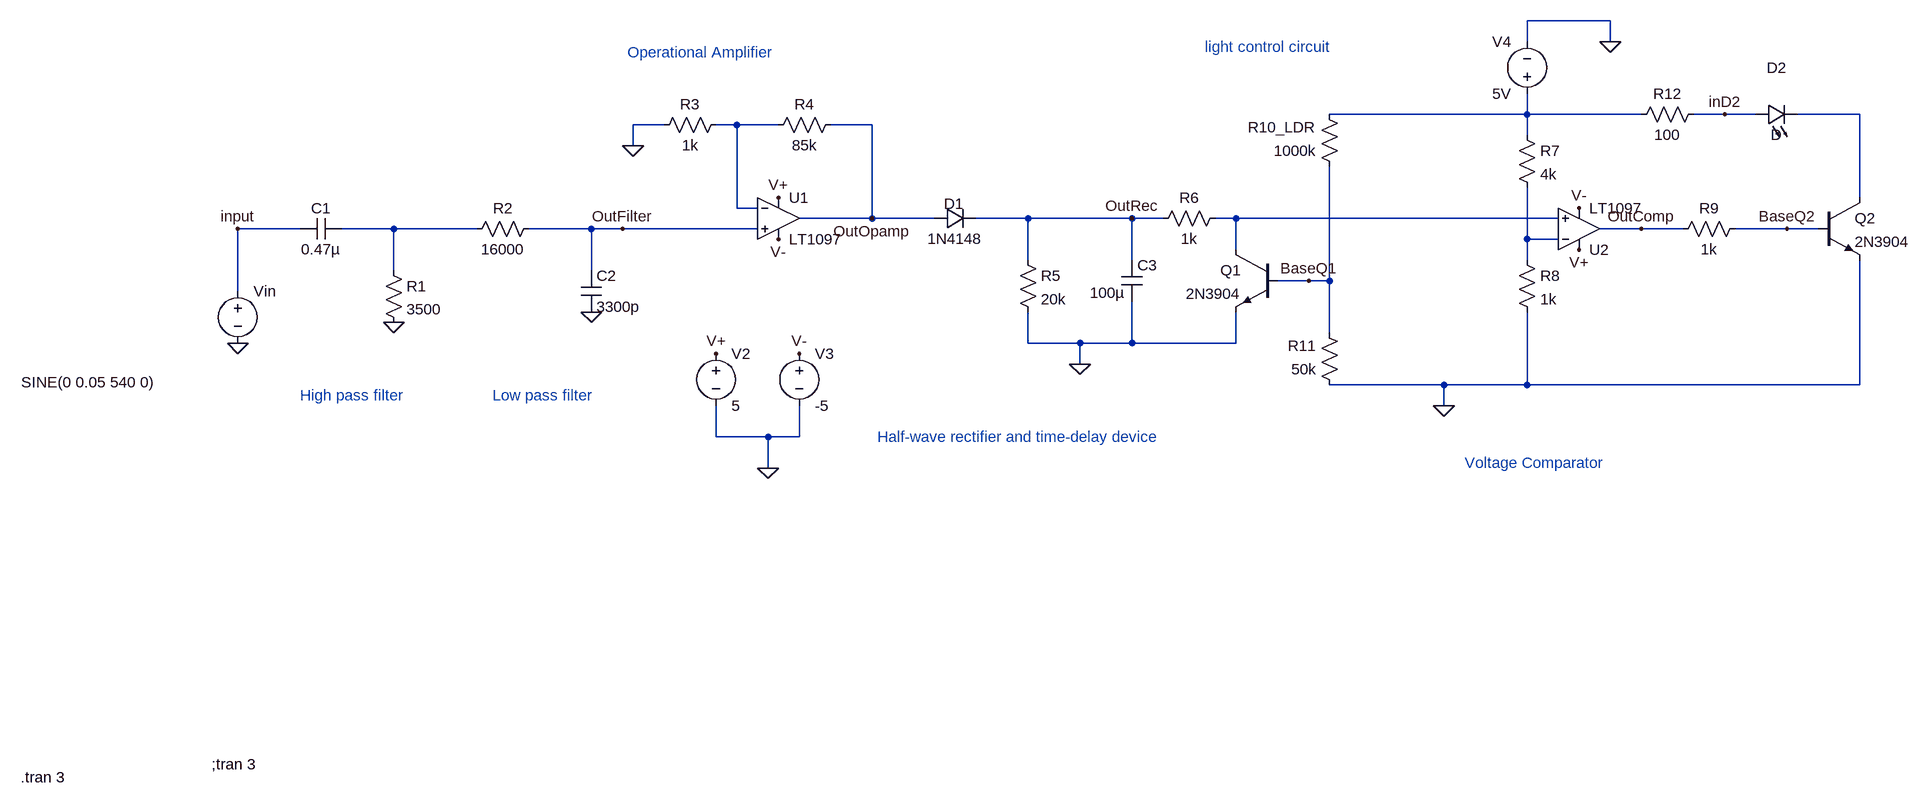
[diagram p0: schematic 3161ProjectDesign.asc]
3161ProjectDesign.asc, the LTspice schematic file:
Version 4
SHEET 1 2792 1004
WIRE 2048 -176 1920 -176
WIRE 1920 -144 1920 -176
WIRE 2048 -144 2048 -176
WIRE 1920 -32 1920 -64
WIRE 1920 -32 1616 -32
WIRE 2096 -32 1920 -32
WIRE 2224 -32 2176 -32
WIRE 2272 -32 2224 -32
WIRE 2432 -32 2336 -32
WIRE 592 -16 544 -16
WIRE 704 -16 672 -16
WIRE 768 -16 704 -16
WIRE 912 -16 848 -16
WIRE 1920 0 1920 -32
WIRE 544 16 544 -16
WIRE 2432 96 2432 -32
WIRE 704 112 704 -16
WIRE 736 112 704 112
WIRE 912 128 912 -16
WIRE 912 128 800 128
WIRE 1008 128 912 128
WIRE 1152 128 1072 128
WIRE 1312 128 1152 128
WIRE 1360 128 1312 128
WIRE 1472 128 1440 128
WIRE 1968 128 1472 128
WIRE 32 144 -64 144
WIRE 176 144 96 144
WIRE 304 144 176 144
WIRE 480 144 384 144
WIRE 528 144 480 144
WIRE 736 144 528 144
WIRE 2096 144 2032 144
WIRE 2160 144 2096 144
WIRE 2320 144 2240 144
WIRE 2368 144 2320 144
WIRE 1920 160 1920 80
WIRE 1968 160 1920 160
WIRE 1472 176 1472 128
WIRE 1152 192 1152 128
WIRE 1312 192 1312 128
WIRE 1920 192 1920 160
WIRE 176 208 176 144
WIRE 480 208 480 144
WIRE 1584 224 1536 224
WIRE 1616 224 1616 48
WIRE 1616 224 1584 224
WIRE -64 240 -64 144
WIRE 1616 304 1616 224
WIRE 1152 320 1152 272
WIRE 1232 320 1152 320
WIRE 1312 320 1312 256
WIRE 1312 320 1232 320
WIRE 1472 320 1472 272
WIRE 1472 320 1312 320
WIRE 1232 352 1232 320
WIRE 1792 384 1616 384
WIRE 1920 384 1920 272
WIRE 1920 384 1792 384
WIRE 2432 384 2432 192
WIRE 2432 384 1920 384
WIRE 1792 416 1792 384
WIRE 672 464 672 416
WIRE 752 464 672 464
WIRE 800 464 800 416
WIRE 800 464 752 464
WIRE 752 512 752 464
FLAG 544 16 0
FLAG 1232 352 0
FLAG 1792 416 0
FLAG 752 512 0
FLAG 672 336 V+
FLAG 800 336 V-
FLAG 2048 -144 0
FLAG 2000 176 V+
FLAG 912 128 OutOpamp
FLAG 768 96 V+
FLAG 768 160 V-
FLAG 2000 112 V-
FLAG -64 320 0
FLAG 176 288 0
FLAG 480 272 0
FLAG 528 144 OutFilter
FLAG -64 144 input
FLAG 1312 128 OutRec
FLAG 2096 144 OutComp
FLAG 2320 144 BaseQ2
FLAG 1584 224 BaseQ1
FLAG 2224 -32 inD2
SYMBOL res 688 -32 R90
WINDOW 0 0 56 VBottom 2
WINDOW 3 32 56 VTop 2
SYMATTR InstName R3
SYMATTR Value 1k
SYMBOL res 864 -32 R90
WINDOW 0 0 56 VBottom 2
WINDOW 3 32 56 VTop 2
SYMATTR InstName R4
SYMATTR Value 85k
SYMBOL res 1136 176 R0
SYMATTR InstName R5
SYMATTR Value 20k
SYMBOL OpAmps\\LT1097 2000 208 M180
SYMATTR InstName U2
SYMBOL res 1904 -16 R0
SYMATTR InstName R7
SYMATTR Value 4k
SYMBOL res 1904 176 R0
SYMATTR InstName R8
SYMATTR Value 1k
SYMBOL voltage 672 320 R0
WINDOW 123 0 0 Left 0
WINDOW 39 0 0 Left 0
SYMATTR InstName V2
SYMATTR Value 5
SYMBOL voltage 800 320 R0
WINDOW 123 0 0 Left 0
WINDOW 39 0 0 Left 0
SYMATTR InstName V3
SYMATTR Value -5
SYMBOL voltage 1920 -48 R180
WINDOW 0 24 96 Left 2
WINDOW 3 24 16 Left 2
WINDOW 123 0 0 Left 0
WINDOW 39 0 0 Left 0
SYMATTR InstName V4
SYMATTR Value 5V
SYMBOL cap 1296 192 R0
WINDOW 3 -49 50 Left 2
SYMATTR Value 100µ
SYMATTR InstName C3
SYMBOL diode 1008 144 R270
WINDOW 0 23 30 VTop 2
WINDOW 3 0 32 VBottom 2
SYMATTR InstName D1
SYMATTR Value 1N4148
SYMBOL npn 1536 176 M0
SYMATTR InstName Q1
SYMATTR Value 2N3904
SYMBOL res 1632 64 R180
WINDOW 0 36 76 Left 2
WINDOW 3 36 40 Left 2
SYMATTR InstName R10_LDR
SYMATTR Value 1000k
SYMBOL res 1632 400 R180
WINDOW 0 36 76 Left 2
WINDOW 3 36 40 Left 2
SYMATTR InstName R11
SYMATTR Value 50k
SYMBOL res 2256 128 R90
WINDOW 0 0 56 VBottom 2
WINDOW 3 32 56 VTop 2
SYMATTR InstName R9
SYMATTR Value 1k
SYMBOL npn 2368 96 R0
SYMATTR InstName Q2
SYMATTR Value 2N3904
SYMBOL LED 2272 -16 R270
WINDOW 0 72 32 VTop 2
WINDOW 3 0 32 VBottom 2
SYMATTR InstName D2
SYMBOL res 2192 -48 R90
WINDOW 0 0 56 VBottom 2
WINDOW 3 32 56 VTop 2
SYMATTR InstName R12
SYMATTR Value 100
SYMBOL res 1456 112 R90
WINDOW 0 0 56 VBottom 2
WINDOW 3 32 56 VTop 2
SYMATTR InstName R6
SYMATTR Value 1k
SYMBOL OpAmps\\LT1097 768 64 R0
SYMATTR InstName U1
SYMBOL voltage -64 224 R0
WINDOW 123 24 44 Left 2
WINDOW 39 0 0 Left 0
WINDOW 3 -333 156 Left 2
SYMATTR Value SINE(0 0.05 540 0)
SYMATTR InstName Vin
SYMBOL cap 96 128 R90
WINDOW 0 0 32 VBottom 2
WINDOW 3 32 32 VTop 2
SYMATTR InstName C1
SYMATTR Value 0.47µ
SYMBOL res 160 192 R0
SYMATTR InstName R1
SYMATTR Value 3500
SYMBOL cap 464 208 R0
SYMATTR InstName C2
SYMATTR Value 3300p
SYMBOL res 400 128 R90
WINDOW 0 0 56 VBottom 2
WINDOW 3 32 56 VTop 2
SYMATTR InstName R2
SYMATTR Value 16000
TEXT 32 400 Left 2 ;High pass filter
TEXT 328 400 Left 2 ;Low pass filter
TEXT -104 968 Left 2 !;tran 3
TEXT 536 -128 Left 2 ;Operational Amplifier
TEXT 920 464 Left 2 ;Half-wave rectifier and time-delay device
TEXT 1824 504 Left 2 ;Voltage Comparator
TEXT 1424 -136 Left 2 ;light control circuit
TEXT -398 988 Left 2 !.tran 3

The netlist it stands for:
* 3161ProjectDesign.asc
R3 N003 0 1k
R4 OutOpamp N003 85k
R5 OutRec 0 20k
XU2 N004 N006 V+ V- OutComp LT1097  ; pins In+ In- V+ V- OUT
R7 N001 N006 4k
R8 N006 0 1k
V2 V+ 0 5
V3 V- 0 -5
V4 N001 0 5V
C3 OutRec 0 100µ
D1 OutOpamp OutRec 1N4148
Q1 N004 BaseQ1 0 0 2N3904
R10_LDR BaseQ1 N001 1000k
R11 0 BaseQ1 50k
R9 BaseQ2 OutComp 1k
Q2 N002 BaseQ2 0 0 2N3904
D2 inD2 N002 D
R12 inD2 N001 100
R6 N004 OutRec 1k
XU1 OutFilter N003 V+ V- OutOpamp LT1097  ; pins In+ In- V+ V- OUT
Vin input 0 SINE(0 0.05 540 0)
C1 N005 input 0.47µ
R1 N005 0 3500
C2 OutFilter 0 3300p
R2 OutFilter N005 16000
.model D D
.lib standard.dio
.model NPN NPN
.model PNP PNP
.lib standard.bjt
* High pass filter
* Low pass filter
;tran 3
* Operational Amplifier
* Half-wave rectifier and time-delay device
* Voltage Comparator
* light control circuit
.tran 3
.backanno
.end